# EAGLE schematic Servorino_FT230X_prototype (EAGLE 9.6.2)
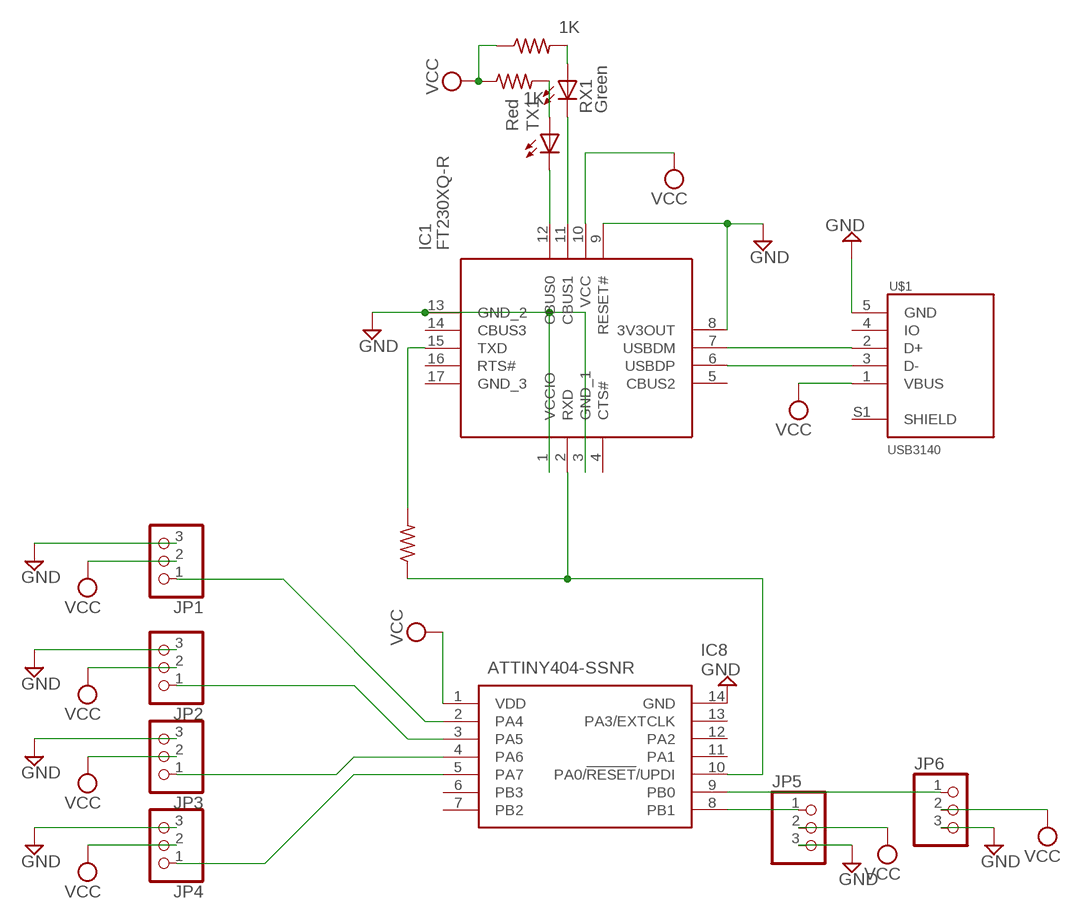
[diagram p0: schematic, sheet 1]

## Parts
IC1  FT230XQ-R  [QFN65P400X400X80-17N]
IC8  ATTINY404-SSNR  [SOIC127P600X175-14N]
JP1  PINHD-1X3  [1X03]
JP2  PINHD-1X3  [1X03]
JP3  PINHD-1X3  [1X03]
JP4  PINHD-1X3  [1X03]
JP5  PINHD-1X3  [1X03]
JP6  PINHD-1X3  [1X03]
R4  1K  R-US_R0805  [R0805]
R5  1K  R-US_R0805  [R0805]
R6  470  R-US_R0805  [R0805]
RX1  Green  LEDCHIP-LED0805  [CHIP-LED0805]
TX1  Red  LEDCHIP-LED0805  [CHIP-LED0805]
U$1  USB3140  [USB3140-30-0170-0-C]

## Nets
GND: IC1.1(VCCIO) IC1.3(GND_1) IC1.8(3V3OUT) IC1.9(RESET#) IC1.13(GND_2) IC8.14(GND) JP1.3 JP2.3 JP3.3 JP4.3 JP5.3 JP6.3 U$1.5(GND)
N$1: IC8.2(PA4) JP1.1
N$2: IC8.9(PB0) JP6.1
N$3: IC8.8(PB1) JP5.1
N$4: IC8.3(PA5) JP2.1
N$5: IC8.4(PA6) JP3.1
N$6: IC8.5(PA7) JP4.1
N$7: R4.2 RX1.A
N$8: R5.2 TX1.A
N$9: IC1.11(CBUS1) RX1.C
N$10: IC1.12(CBUS0) TX1.C
N$11: IC1.15(TXD) R6.2
N$12: IC1.6(USBDP) U$1.3(D-)
N$13: IC1.2(RXD) IC8.10(PA0/!RESET!/UPDI) R6.1
N$14: IC1.7(USBDM) U$1.2(D+)
VCC: IC1.10(VCC) IC8.1(VDD) JP1.2 JP2.2 JP3.2 JP4.2 JP5.2 JP6.2 R4.1 R5.1 U$1.1(VBUS)
Unconnected: IC1.4(CTS#) IC1.5(CBUS2) IC1.14(CBUS3) IC1.16(RTS#) IC1.17(GND_3) IC8.6(PB3) IC8.7(PB2) IC8.11(PA1) IC8.12(PA2) IC8.13(PA3/EXTCLK) U$1.4(IO) U$1.S1(SHIELD)

## Library data of the parts
IC1 = SamacSys_Parts:FT230XQ-R: X-Chip USB to Basic UART Interface FTDI Chip FT230XQ-R UART Interface 3MBd, 5 V, 16-Pin, QFN Source: Datasheet <https://componentsearchengine.com/Datasheets/1/FT230XQ-R.pdf>; DESCRIPTION: X-Chip USB to Basic UART Interface FTDI Chip FT230XQ-R UART Interface 3MBd, 5 V, 16-Pin, QFN; HEIGHT: 0.8mm; MANUFACTURER_NAME: FTDI Chip; MANUFACTURER_PART_NUMBER: FT230XQ-R; MOUSER_PART_NUMBER: 895-FT230XQ-R; MOUSER_PRICE-STOCK: https://www.mouser.co.uk/ProductDetail/FTDI/FT230XQ-R?qs=Gp1Yz1mis3VvmXwyDmIHOg%3D%3D
IC8 = SamacSys_Parts:ATTINY404-SSNR: MICROCHIP - ATTINY404-SSNR - MCU, 8BIT, 20MHZ, SOIC-14 Source: Datasheet <https://datasheet.datasheetarchive.com/originals/distributors/DKDS-39/8204.pdf>; DESCRIPTION: MICROCHIP - ATTINY404-SSNR - MCU, 8BIT, 20MHZ, SOIC-14; HEIGHT: 1.75mm; MANUFACTURER_NAME: Microchip; MANUFACTURER_PART_NUMBER: ATTINY404-SSNR; MOUSER_PART_NUMBER: 556-ATTINY404-SSNR; MOUSER_PRICE-STOCK: https://www.mouser.co.uk/ProductDetail/Microchip-Technology-Atmel/ATTINY404-SSNR?qs=F5EMLAvA7IAEqD7Aw0z%252B9Q%3D%3D
JP1-JP6 = pinhead:PINHD-1X3: PIN HEADER
R4-R6 = adafruit:R-US_: RESISTOR, American symbol
RX1 TX1 = adafruit:LED: LED OSRAM: - CHIPLED LG R971, LG N971, LY N971, LG Q971, LY Q971, LO R971, LY R971 LH N974, LH R974 LS Q976, LO Q976, LY Q976 LO Q996 - Hyper CHIPLED LW Q18S LB Q993, LB Q99A, LB R99A - SideLED LS A670, LO A670, LY A670, LG A670, LP A670 LB A673, LV A673, LT A673, LW A673 LH A674 LY A675 LS A676, LA A676, LO A676, LY A676, LW A676 LS A679, LY A679, LG A679 - Hyper Micro SIDELED® LS Y876, LA Y876, LO Y876, LY Y876 LT Y87S - SmartLED LW L88C, LW L88S LB L89C, LB L89S, LG L890 LS L89K, LO L89K, LY L89K LS L896, LA L896, LO L896, LY L896 - TOPLED LS T670, LO T670, LY T670, LG T670, LP T670 LSG T670, LSP T670, LSY T670, LOP T670, LYG T670 LG T671, LOG T671, LSG T671 LB T673, LV T673, LT T673, LW T673 LH T674 LS T676, LA T676, LO T676, LY T676, LB T676, LH T676, LSB T676, LW T676 LB T67C, LV T67C, LT T67C, LS T67K, LO T67K, LY T67K, LW E67C LS E67B, LA E67B, LO E67B, LY E67B, LB E67C, LV E67C, LT E67C LW T67C LS T679, LY T679, LG T679 LS T770, LO T770, LY T770, LG T770, LP T770 LB T773, LV T773, LT T773, LW T773 LH T774 LS E675, LA E675, LY E675, LS T675 LS T776, LA T776, LO T776, LY T776, LB T776 LHGB T686 LT T68C, LB T68C - Hyper Mini TOPLED® LB M676 - Mini TOPLED Santana® LG M470 LS M47K, LO M47K, LY M47K Source: http://www.osram.convergy.de/
U$1 = USB:USB3140